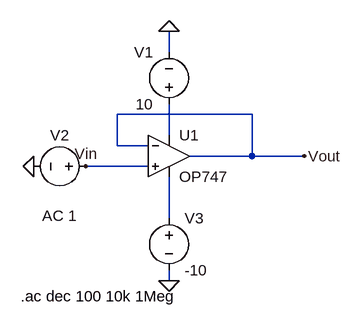
[diagram p0: schematic Lab9_1.asc]
Lab9_1.asc, the LTspice schematic file:
Version 4
SHEET 1 880 680
WIRE 128 0 128 -32
WIRE 256 96 48 96
WIRE 128 128 128 80
WIRE 48 144 48 96
WIRE 96 144 48 144
WIRE 256 160 256 96
WIRE 256 160 160 160
WIRE 336 160 256 160
WIRE 96 176 0 176
WIRE 128 256 128 192
WIRE 128 352 128 336
FLAG 336 160 Vout
FLAG 0 176 Vin
FLAG 128 -32 0
FLAG 128 352 0
FLAG -80 176 0
SYMBOL OpAmps\\OP747 128 96 R0
SYMATTR InstName U1
SYMBOL voltage 128 96 R180
WINDOW 0 24 96 Left 2
WINDOW 3 24 16 Left 2
WINDOW 123 0 0 Left 0
WINDOW 39 0 0 Left 0
SYMATTR InstName V1
SYMATTR Value 10
SYMBOL voltage 16 176 R90
WINDOW 0 -32 56 VBottom 2
WINDOW 3 32 56 VTop 2
WINDOW 123 60 56 VTop 2
WINDOW 39 0 0 Left 0
SYMATTR InstName V2
SYMATTR Value ""
SYMATTR Value2 AC 1
SYMBOL voltage 128 240 R0
WINDOW 123 0 0 Left 0
WINDOW 39 0 0 Left 0
SYMATTR InstName V3
SYMATTR Value -10
TEXT -100 376 Left 2 !.ac dec 100 10k 1Meg

The netlist it stands for:
* Lab9_1.asc
XU1 Vin Vout N001 N002 Vout OP747  ; pins In+ In- V+ V- OUT
V1 N001 0 10
V2 Vin 0 AC 1
V3 N002 0 -10
.ac dec 100 10k 1Meg
.backanno
.end